# Altium schematic sheet COVER_PAGE.SchDoc
size A4; SheetNumber: 2; SheetTotal: 11
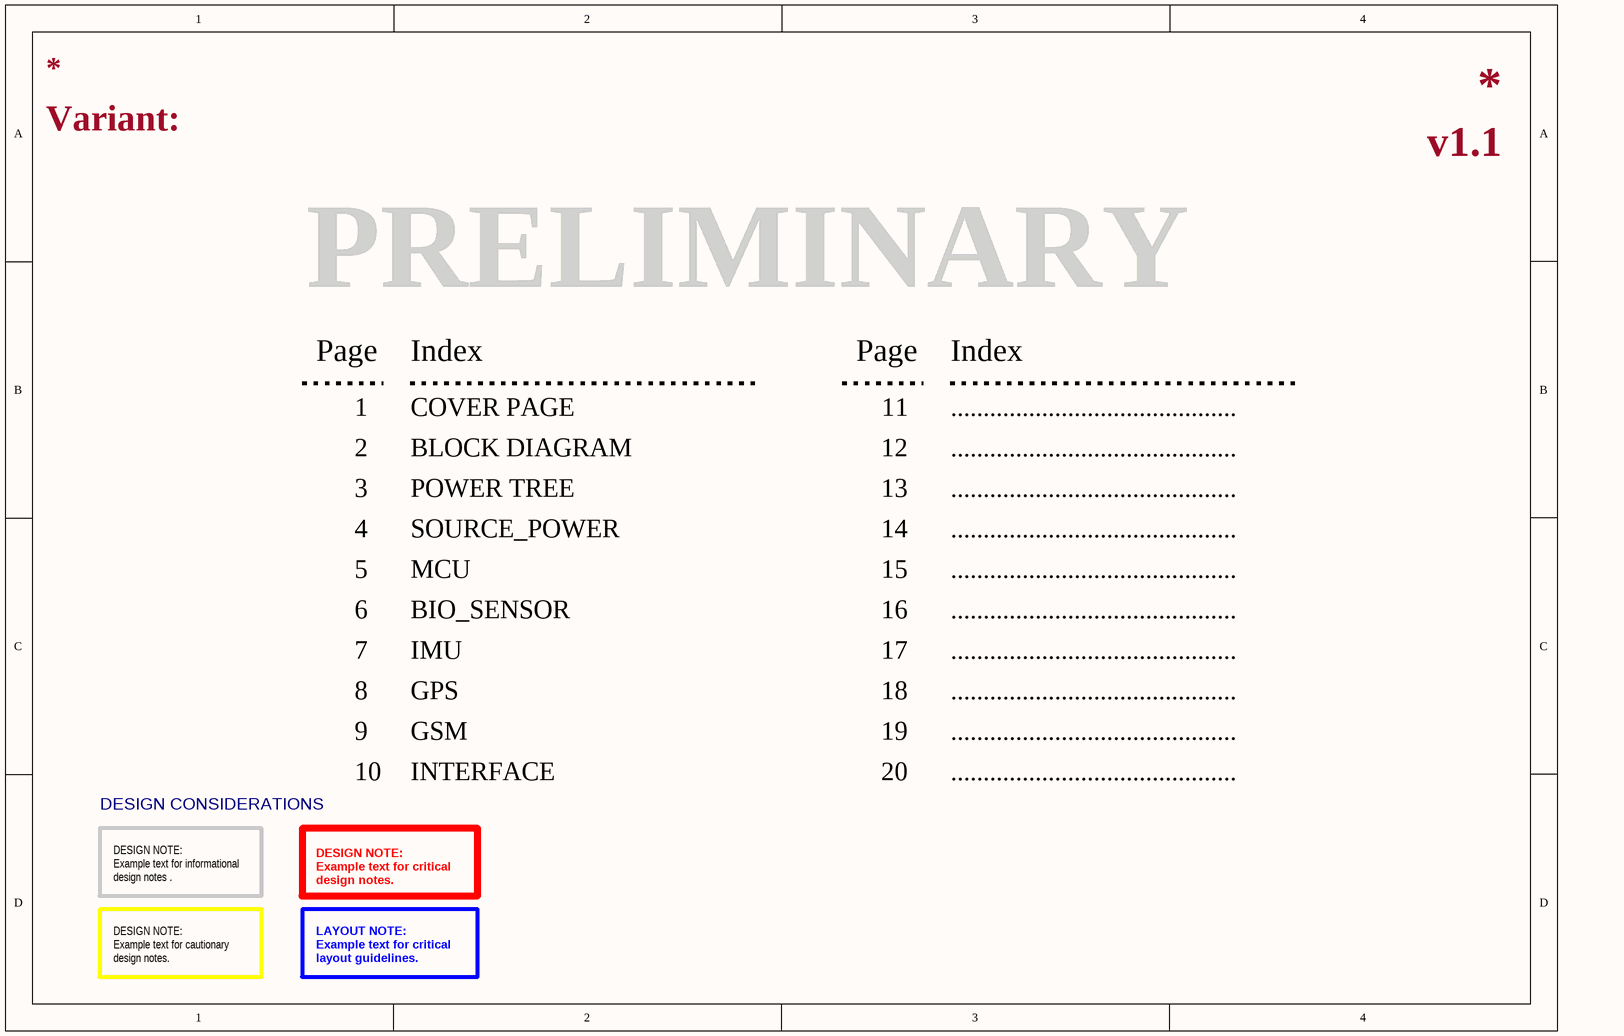
[diagram p0: COVER_PAGE.SchDoc]

## Notes on the sheet
- Variant:
- v1.1
- PRELIMINARY
- Page
- Index
- 1
- COVER PAGE
- 11
- ............................................
- 2
- 3
- BLOCK DIAGRAM
- POWER TREE
- 12
- 13
- 4
- 5
- SOURCE_POWER
- MCU
- 14
- 15
- 6
- BIO_SENSOR
- 16
- 7
- 8
- GPS
- IMU
- 17
- 18
- 9
- 10
- GSM
- INTERFACE
- 19
- 20
- DESIGN CONSIDERATIONS
- DESIGN NOTE:
  Example text for informational
  design notes .
- DESIGN NOTE:
  Example text for critical
  design notes.
- DESIGN NOTE:
  Example text for cautionary
  design notes.
- LAYOUT NOTE:
  Example text for critical
  layout guidelines.